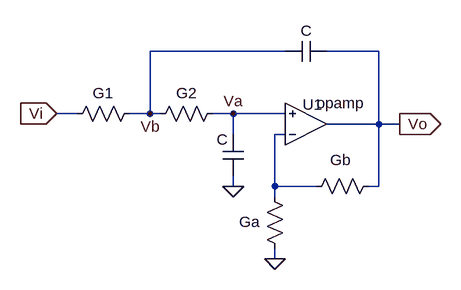
[diagram p0: schematic Sallen Key dibujo.asc]
Sallen Key dibujo.asc, the LTspice schematic file:
Version 4
SHEET 1 880 680
WIRE 192 48 -16 48
WIRE 336 48 256 48
WIRE -128 144 -160 144
WIRE -16 144 -16 48
WIRE -16 144 -48 144
WIRE 0 144 -16 144
WIRE 112 144 80 144
WIRE 192 144 112 144
WIRE 336 160 336 48
WIRE 336 160 256 160
WIRE 368 160 336 160
WIRE 112 176 112 144
WIRE 192 176 176 176
WIRE 112 256 112 240
WIRE 176 256 176 176
WIRE 240 256 176 256
WIRE 336 256 336 160
WIRE 336 256 320 256
WIRE 176 272 176 256
WIRE 176 368 176 352
FLAG 176 368 0
FLAG 112 256 0
FLAG -160 144 Vi
IOPIN -160 144 In
FLAG 368 160 Vo
IOPIN 368 160 Out
FLAG 112 144 Va
FLAG -16 144 Vb
SYMBOL OpAmps\\opamp 224 224 M180
WINDOW 0 -5 94 Left 2
SYMATTR InstName U1
SYMBOL res -32 128 R90
WINDOW 0 0 56 VBottom 2
WINDOW 3 32 56 VTop 2
SYMATTR InstName G1
SYMATTR Value ""
SYMBOL res 96 128 R90
WINDOW 0 0 56 VBottom 2
WINDOW 3 32 56 VTop 2
SYMATTR InstName G2
SYMATTR Value ""
SYMBOL res 192 368 R180
WINDOW 0 39 57 Left 2
WINDOW 3 36 19 Left 2
SYMATTR InstName Ga
SYMATTR Value ""
SYMBOL res 224 272 R270
WINDOW 0 41 53 VTop 2
WINDOW 3 0 56 VBottom 2
SYMATTR InstName Gb
SYMATTR Value ""
SYMBOL cap 256 32 R90
WINDOW 0 0 32 VBottom 2
WINDOW 3 32 32 VTop 2
SYMATTR InstName C
SYMATTR Value ""
SYMBOL cap 128 240 R180
WINDOW 0 24 56 Left 2
WINDOW 3 24 8 Left 2
SYMATTR InstName C
SYMATTR Value ""

The netlist it stands for:
* Sallen Key dibujo.asc
XU1 N001 Va Vo opamp Aol=100K GBW=10Meg  ; pins invin noninvin out
R§G1 Vb Vi
R§G2 Va Vb
R§Ga 0 N001
R§Gb N001 Vo
C Vo Vb
C 0 Va
.backanno
.end